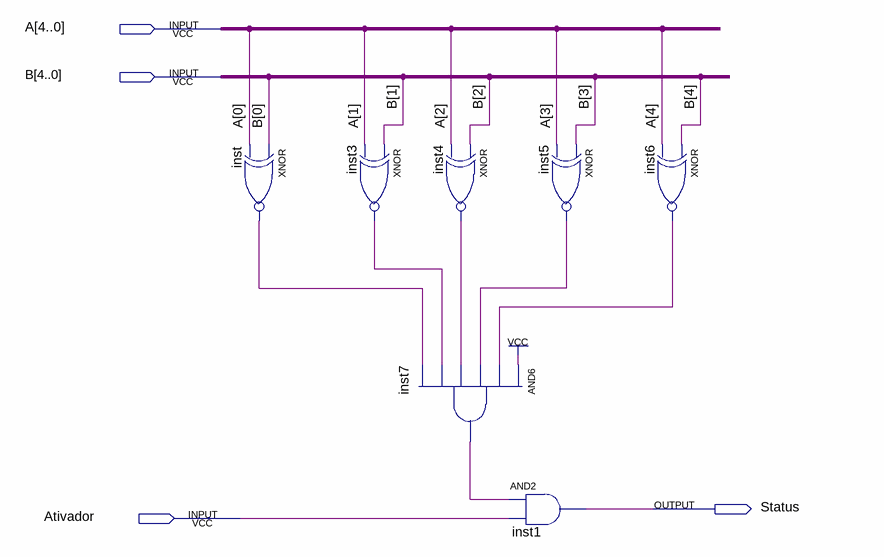
[diagram p0: schematic sheet]
// Quartus schematic AigualB.bdf as structural Verilog: 7 symbols, 4 pins
module AigualB (
  input  [4:0] A,
  input  [4:0] B,
  input  Ativador,
  output Status
);

  wire inst3_out, inst4_out, inst5_out, inst6_out, inst7_out, inst_out;

  xnor inst (inst_out, B[0], A[0]);
  xnor inst3 (inst3_out, B[1], A[1]);
  xnor inst4 (inst4_out, B[2], A[2]);
  and inst7 (inst7_out, 1'b1, inst6_out, inst5_out, inst4_out, inst3_out, inst_out);
  and inst1 (Status, inst7_out, Ativador);
  xnor inst5 (inst5_out, B[3], A[3]);
  xnor inst6 (inst6_out, B[4], A[4]);
endmodule
